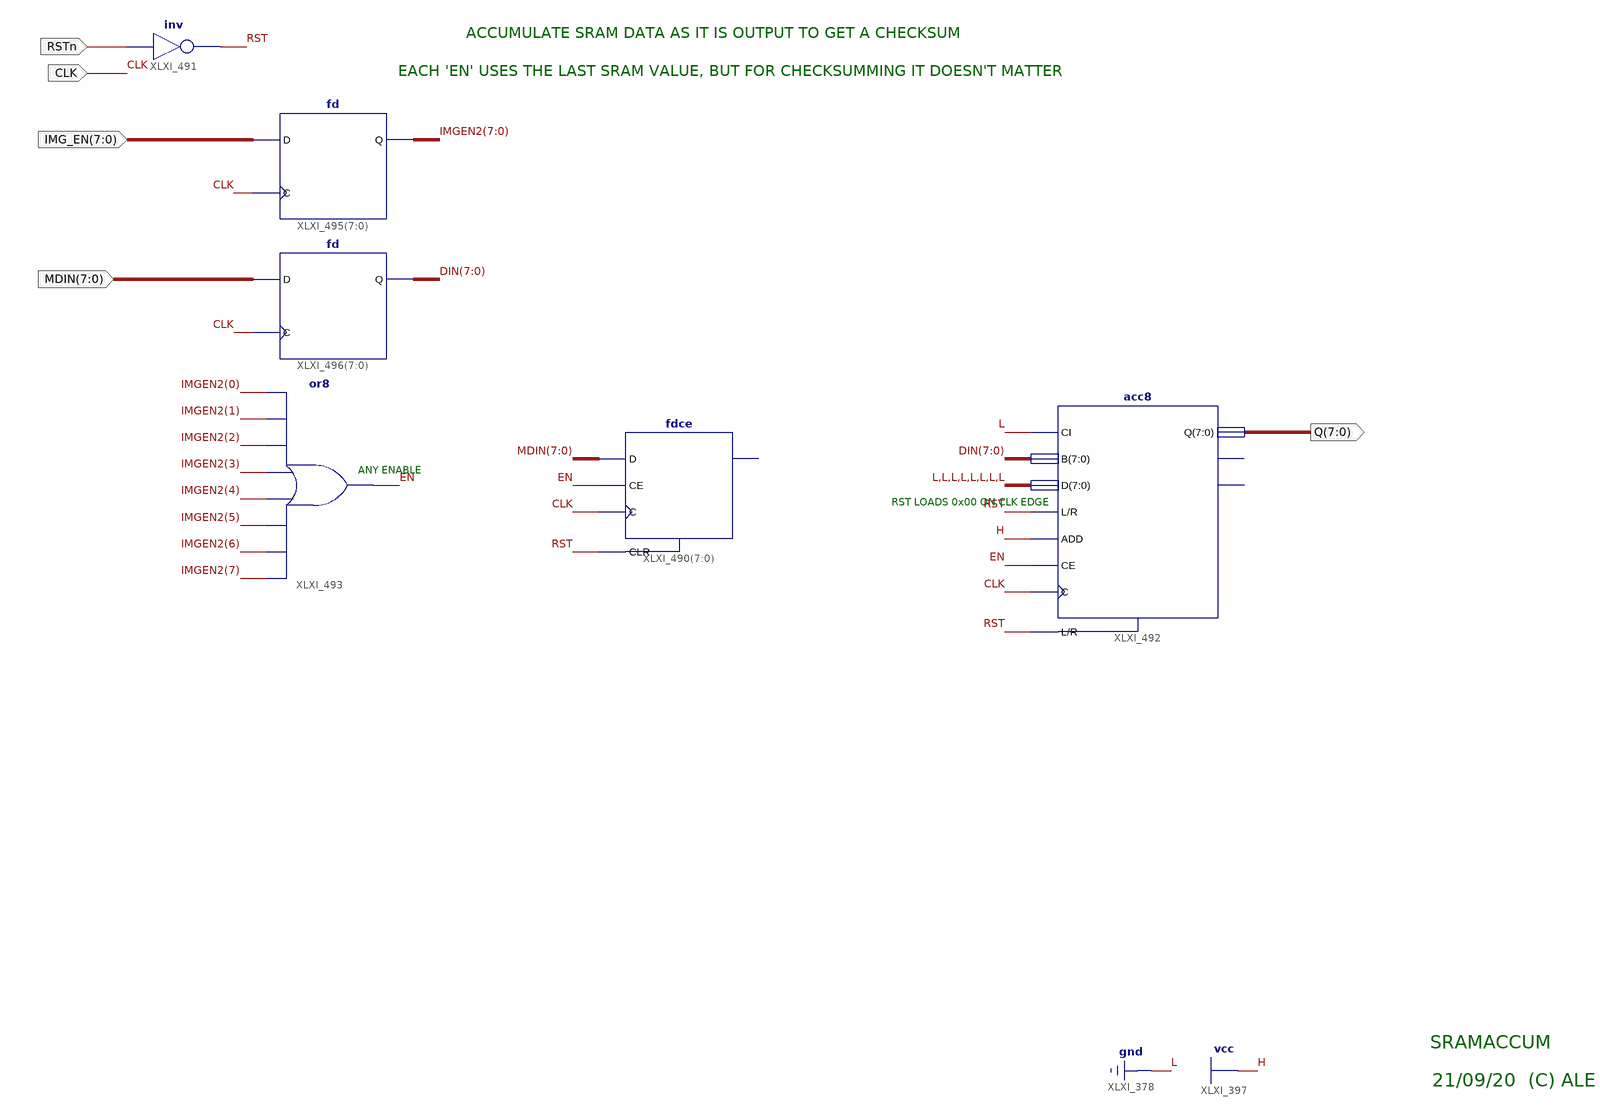
[diagram p0: schematic sheet 1]
// Xilinx ISE schematic SramAccum.sch (spartan3e) as structural Verilog: 6 symbols, 5 ports
module SramAccum (
  input  CLK,
  input  RSTn,
  input  [7:0] MDIN,
  input  [7:0] IMG_EN,
  output [7:0] Q
);

  wire EN, RST;
  wire [7:0] DIN, IMGEN2;

  not XLXI_491 (RST, RSTn);
  acc8 XLXI_492 (
    .ADD(1'b1), .B(DIN), .C(CLK), .CE(EN), .CI(1'b0), .D({8{1'b0}}), .L(RST), .R(RST), .Q(Q));  // open: CO, OFL
  or XLXI_493 (EN, IMGEN2[7], IMGEN2[6], IMGEN2[5], IMGEN2[4], IMGEN2[3], IMGEN2[2], IMGEN2[1], IMGEN2[0]);
  fdce XLXI_490[7:0] (.C(CLK), .CE(EN), .CLR(RST), .D(MDIN));  // open: Q
  fd XLXI_495[7:0] (.C(CLK), .D(IMG_EN), .Q(IMGEN2));
  fd XLXI_496[7:0] (.C(CLK), .D(MDIN), .Q(DIN));

  // Notes on the sheet:
  //   ACCUMULATE SRAM DATA AS IT IS OUTPUT TO GET A CHECKSUM
  //   EACH 'EN' USES THE LAST SRAM VALUE, BUT FOR CHECKSUMMING IT DOESN'T MATTER
  //   ANY ENABLE
  //   RST LOADS 0x00 ON CLK EDGE
  //   SRAMACCUM
  //   21/09/20  (C) ALE
endmodule
